# EAGLE design unoedge_v3 (EAGLE 6.5.0)
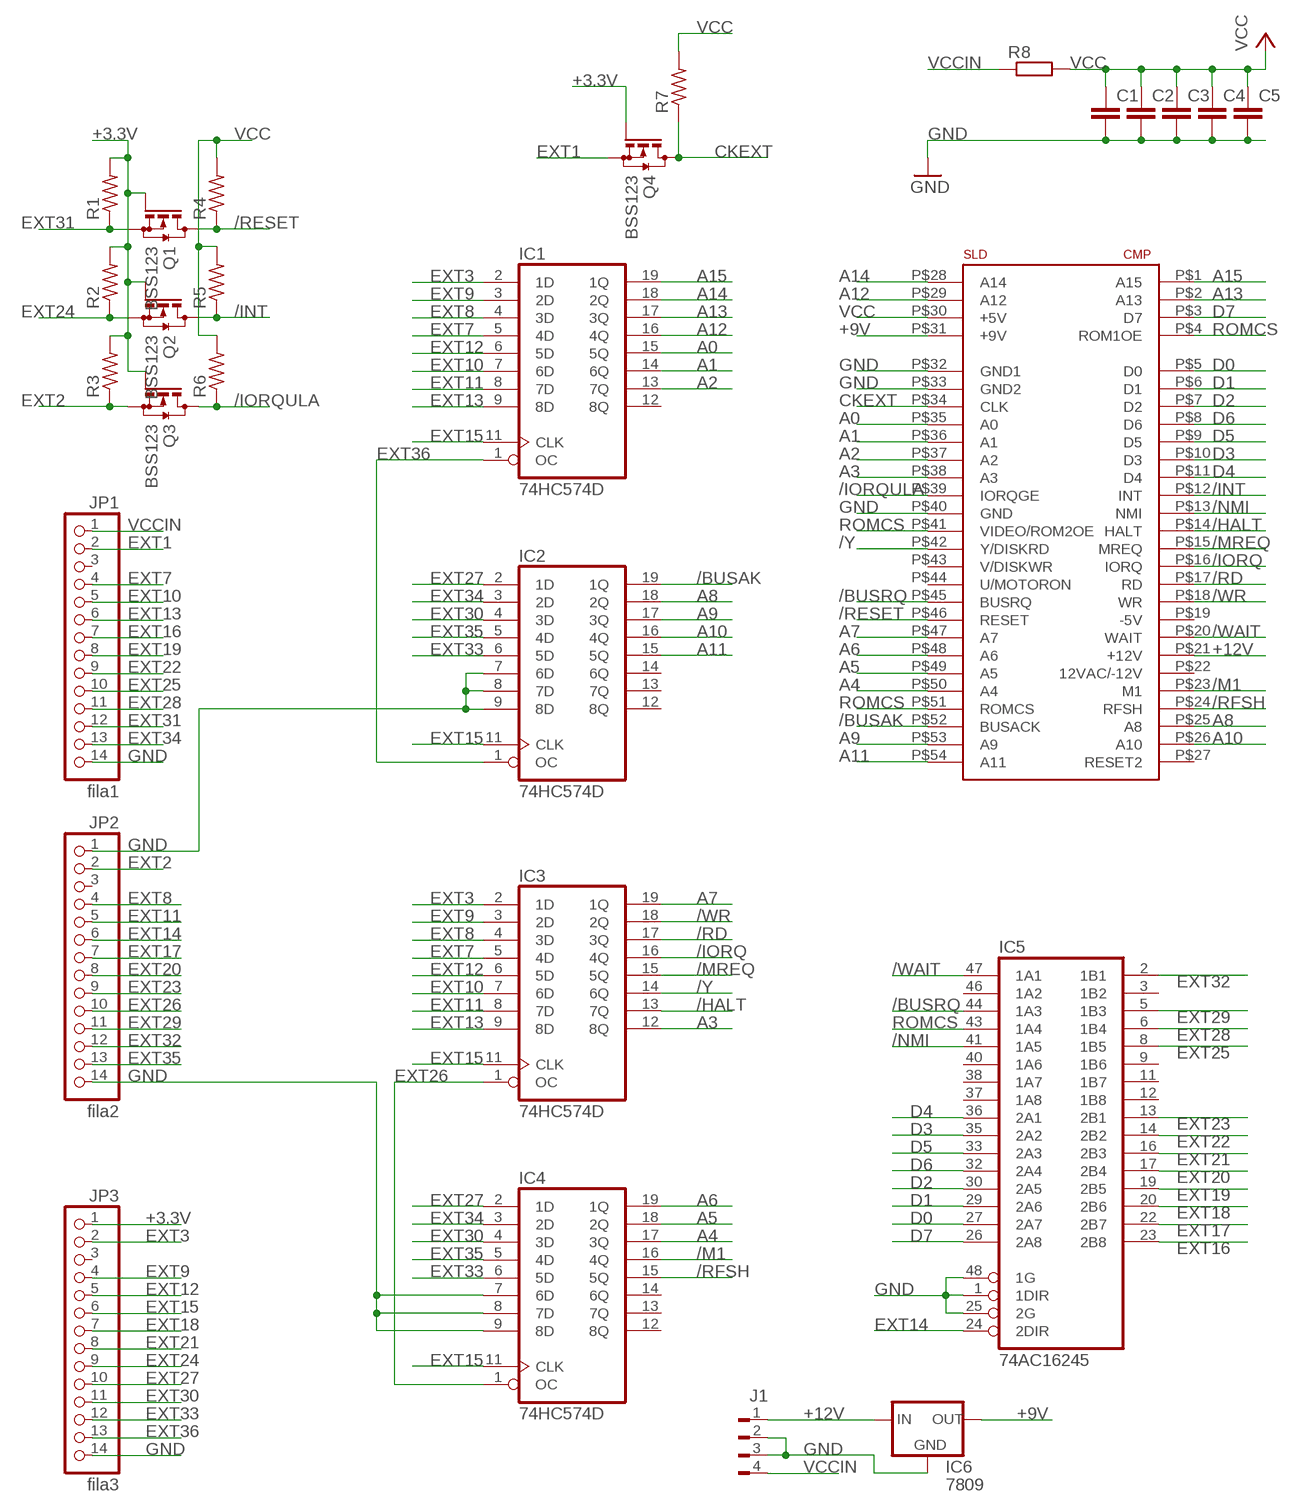
[diagram p0: schematic, sheet 1]

## Parts
C1  C-EUC0603  [C0603]
C2  C-EUC0603  [C0603]
C3  C-EUC0603  [C0603]
C4  C-EUC0603  [C0603]
C5  C-EUC0603  [C0603]
IC1  74HC574D  [SO20W]
IC2  74HC574D  [SO20W]
IC3  74HC574D  [SO20W]
IC4  74HC574D  [SO20W]
IC5  74AC16245  [SSOP48DL]
IC6  7809  78XXS  [78XXS]
J1  FLOP-4W827001  [827001]
JP1  fila1  PINHD-1X14  [1X14]
JP2  fila2  PINHD-1X14  [1X14]
JP3  fila3  PINHD-1X14  [1X14]
Q1  BSS123  [SOT23]
Q2  BSS123  [SOT23]
Q3  BSS123  [SOT23]
Q4  BSS123  [SOT23]
R1  R-US_M0805  [M0805]
R2  R-US_M0805  [M0805]
R3  R-US_M0805  [M0805]
R4  R-US_M0805  [M0805]
R5  R-US_M0805  [M0805]
R6  R-US_M0805  [M0805]
R7  R-US_M0805  [M0805]
R8  R-EU_M0805  [M0805]
U$2  CONECTOR_EDGE_LADO_SPECTRUM  [CONECTOR_LADO_SPECTRUM]

## Nets
+3.3V: JP3.1 Q1.1(G) Q2.1(G) Q3.1(G) Q4.1(G) R1.2 R2.2 R3.2
+9V: IC6.OUT U$2.P$31(+9V)
+12V: IC6.IN J1.1 U$2.P$21(+12V)
/BUSAK: IC2.19(1Q) U$2.P$52(BUSACK)
/BUSRQ: IC5.44(1A3) U$2.P$45(BUSRQ)
/HALT: IC3.13(7Q) U$2.P$14(HALT)
/INT: Q2.3(D) R5.1 U$2.P$12(INT)
/IORQ: IC3.16(4Q) U$2.P$16(IORQ)
/IORQULA: Q3.3(D) R6.1 U$2.P$39(IORQGE)
/M1: IC4.16(4Q) U$2.P$23(M1)
/MREQ: IC3.15(5Q) U$2.P$15(MREQ)
/NMI: IC5.41(1A5) U$2.P$13(NMI)
/RD: IC3.17(3Q) U$2.P$17(RD)
/RESET: Q1.3(D) R4.1 U$2.P$46(RESET)
/RFSH: IC4.15(5Q) U$2.P$24(RFSH)
/WAIT: IC5.47(1A1) U$2.P$20(WAIT)
/WR: IC3.18(2Q) U$2.P$18(WR)
/Y: IC3.14(6Q) U$2.P$42(Y/DISKRD)
A0: IC1.15(5Q) U$2.P$35(A0)
A1: IC1.14(6Q) U$2.P$36(A1)
A2: IC1.13(7Q) U$2.P$37(A2)
A3: IC3.12(8Q) U$2.P$38(A3)
A4: IC4.17(3Q) U$2.P$50(A4)
A5: IC4.18(2Q) U$2.P$49(A5)
A6: IC4.19(1Q) U$2.P$48(A6)
A7: IC3.19(1Q) U$2.P$47(A7)
A8: IC2.18(2Q) U$2.P$25(A8)
A9: IC2.17(3Q) U$2.P$53(A9)
A10: IC2.16(4Q) U$2.P$26(A10)
A11: IC2.15(5Q) U$2.P$54(A11)
A12: IC1.16(4Q) U$2.P$29(A12)
A13: IC1.17(3Q) U$2.P$2(A13)
A14: IC1.18(2Q) U$2.P$28(A14)
A15: IC1.19(1Q) U$2.P$1(A15)
CKEXT: Q4.3(D) R7.1 U$2.P$34(CLK)
D0: IC5.27(2A7) U$2.P$5(D0)
D1: IC5.29(2A6) U$2.P$6(D1)
D2: IC5.30(2A5) U$2.P$7(D2)
D3: IC5.35(2A2) U$2.P$10(D3)
D4: IC5.36(2A1) U$2.P$11(D4)
D5: IC5.33(2A3) U$2.P$9(D5)
D6: IC5.32(2A4) U$2.P$8(D6)
D7: IC5.26(2A8) U$2.P$3(D7)
EXT1: JP1.2 Q4.2(S)
EXT2: JP2.2 Q3.2(S) R3.1
EXT3: IC1.2(1D) IC3.2(1D) JP3.2
EXT7: IC1.5(4D) IC3.5(4D) JP1.4
EXT8: IC1.4(3D) IC3.4(3D) JP2.4
EXT9: IC1.3(2D) IC3.3(2D) JP3.4
EXT10: IC1.7(6D) IC3.7(6D) JP1.5
EXT11: IC1.8(7D) JP2.5
EXT12: IC1.6(5D) IC3.6(5D) JP3.5
EXT13: IC1.9(8D) IC3.9(8D) JP1.6
EXT14: IC5.24(2DIR) JP2.6
EXT15: IC1.11(CLK) IC2.11(CLK) IC3.11(CLK) IC4.11(CLK) JP3.6
EXT16: IC5.23(2B8) JP1.7
EXT17: IC5.22(2B7) JP2.7
EXT18: IC5.20(2B6) JP3.7
EXT19: IC5.19(2B5) JP1.8
EXT20: IC5.17(2B4) JP2.8
EXT21: IC5.16(2B3) JP3.8
EXT22: IC5.14(2B2) JP1.9
EXT23: IC5.13(2B1) JP2.9
EXT24: JP3.9 Q2.2(S) R2.1
EXT25: IC5.8(1B5) JP1.10
EXT26: IC3.1(OC) IC4.1(OC) JP2.10
EXT27: IC2.2(1D) IC4.2(1D) JP3.10
EXT28: IC5.6(1B4) JP1.11
EXT29: IC5.5(1B3) JP2.11
EXT30: IC2.4(3D) IC4.4(3D) JP3.11
EXT31: JP1.12 Q1.2(S) R1.1
EXT32: IC5.2(1B1) JP2.12
EXT33: IC2.6(5D) IC4.6(5D) JP3.12
EXT34: IC2.3(2D) IC4.3(2D) JP1.13
EXT35: IC2.5(4D) IC4.5(4D) JP2.13
EXT36: IC1.1(OC) IC2.1(OC) JP3.13
GND: C1.2 C2.2 C3.2 C4.2 C5.2 IC2.7(6D) IC2.8(7D) IC2.9(8D) IC4.7(6D) IC4.8(7D) IC4.9(8D) IC5.1(1DIR) IC5.25(2G) IC5.48(1G) IC6.GND J1.2 J1.3 JP1.14 JP2.1 JP2.14 JP3.14 U$2.P$32(GND1) U$2.P$33(GND2) U$2.P$40(GND)
ROMCS: IC5.43(1A4) U$2.P$4(ROM1OE) U$2.P$41(VIDEO/ROM2OE) U$2.P$51(ROMCS)
VCC: C1.1 C2.1 C3.1 C4.1 C5.1 R4.2 R5.2 R6.2 R7.2 R8.2 U$2.P$30(+5V)
VCCIN: J1.4 JP1.1 R8.1
Unconnected: IC1.12(8Q) IC2.12(8Q) IC2.13(7Q) IC2.14(6Q) IC3.8(7D) IC4.12(8Q) IC4.13(7Q) IC4.14(6Q) IC5.3(1B2) IC5.9(1B6) IC5.11(1B7) IC5.12(1B8) IC5.37(1A8) IC5.38(1A7) IC5.40(1A6) IC5.46(1A2) JP1.3 JP2.3 JP3.3 U$2.P$19(-5V) U$2.P$22(12VAC/-12V) U$2.P$27(RESET2) U$2.P$43(V/DISKWR) U$2.P$44(U/MOTORON)

## Power pins joined to a net without a drawn wire
GND: IC1.10(GND) IC2.10(GND) IC3.10(GND) IC4.10(GND) IC5.4(GND) IC5.10(GND) IC5.15(GND) IC5.21(GND) IC5.28(GND) IC5.34(GND) IC5.39(GND) IC5.45(GND)
VCC: IC1.20(VCC) IC2.20(VCC) IC3.20(VCC) IC4.20(VCC) IC5.7(VCC) IC5.18(VCC) IC5.31(VCC) IC5.42(VCC)

## Library data of the parts
C1-C5 = rcl:C-EU: CAPACITOR, European symbol
IC1-IC4 = 74xx-eu:74*574: 8-bit D type FLIP FLOP bus driver
IC5 = 74ac-logic:74AC16245: 16-bit BUS TRANSCEIVER, 3-state
IC6 = v-reg:78XXS: VOLTAGE REGULATOR
J1 = con-amp:FLOP-4W: MATE N-LOCK Floppy / HDD conector Distributor: Bürklin 71F972
JP1-JP3 = pinhead:PINHD-1X14: PIN HEADER
Q1-Q4 = transistor-small-signal:BSS123: N-CHANNEL MOS FET
R1-R7 = rcl:R-US_: RESISTOR, American symbol
R8 = rcl:R-EU_: RESISTOR, European symbol
U$2 = zx_bus_connector_lado_spectrum:CONECTOR_EDGE_LADO_SPECTRUM

## Board
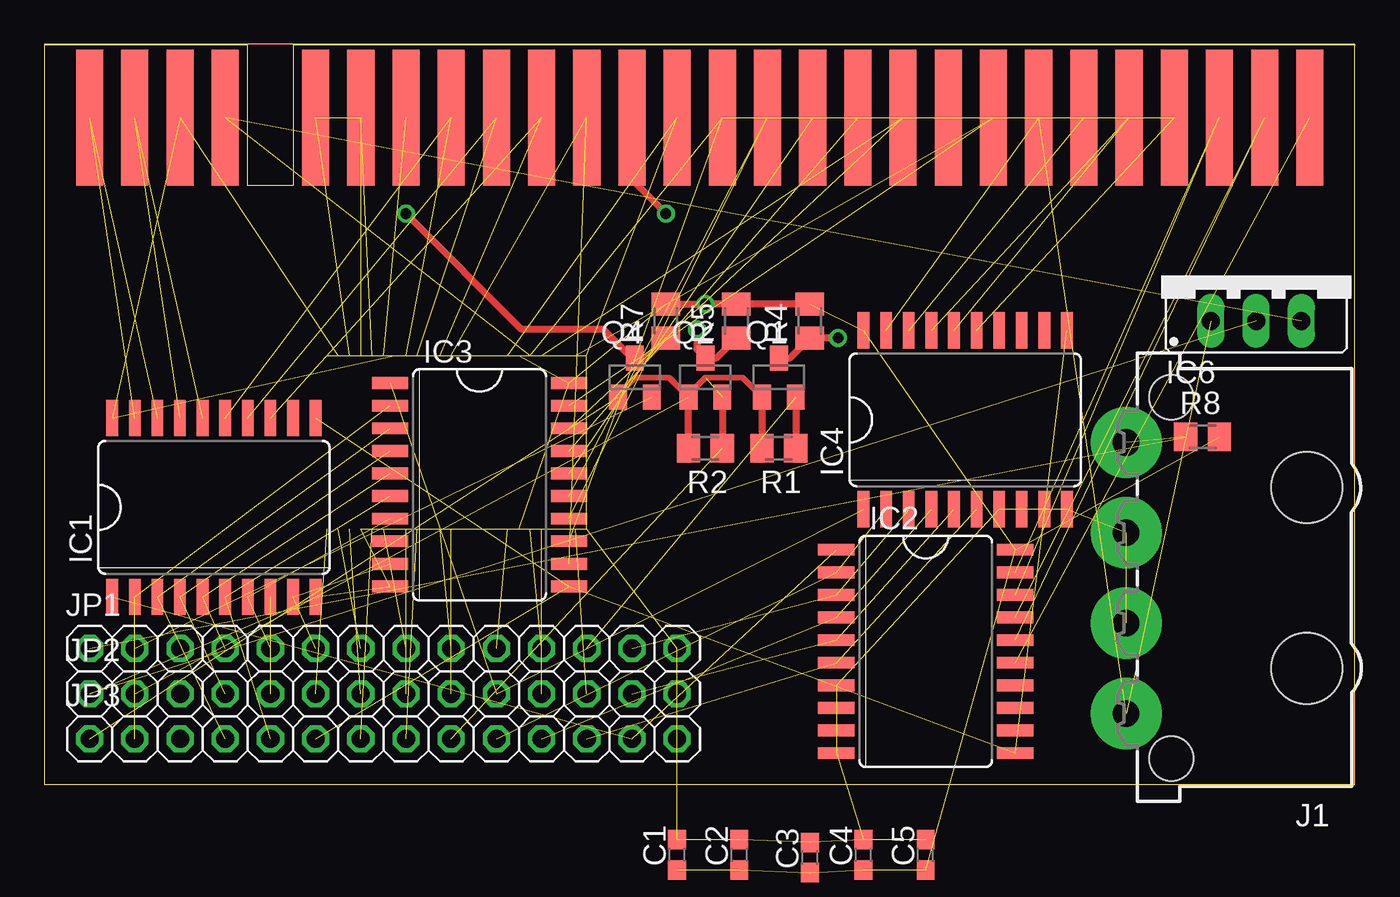
[diagram p1: board, top side]
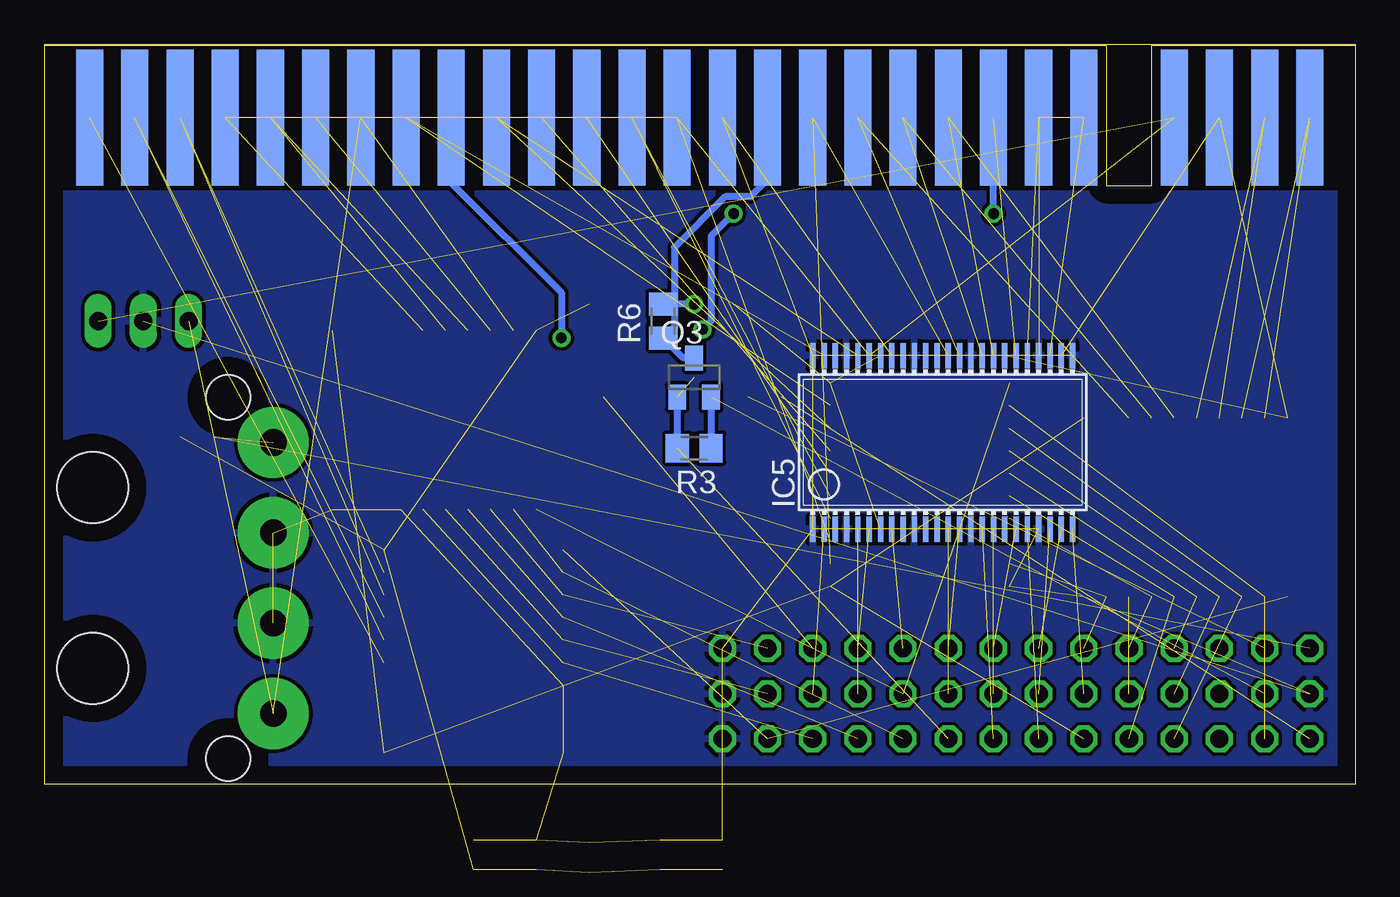
[diagram p2: board, bottom side, seen from below]

Size 73.66 x 41.58 mm. Coordinates in mm from the lower left corner, seen from the top.
Outline: 0,0 73.64,0 73.64,41.58 0,41.58 0,0
Copper layers (1*16): Top 0.035mm / dielectric 1.5mm / Bottom 0.035mm
Design rules "default": minimum track width 10mil, minimum drill 24mil, track to track 8mil, track to pad 8mil, pad to pad 8mil, via to via 8mil, smd to smd 8mil, copper to edge 40mil, drill to drill 8mil, minimum pad ring 10mil, minimum via ring 8mil, stop-mask expansion 4mil, vias tented up to drill 0mil, thermal gap 10mil

### Footprints (pad centres in the part's own frame; a part is rotated, then mirrored left to right if it is on the bottom)
C0603 = smd 1.1 x 1: 1 -0.85,0; 2 0.85,0
SO20W = smd 0.66 x 2.032: 1 -5.715,-5.029; 2 -4.445,-5.029; 3 -3.175,-5.029; 4 -1.905,-5.029; 5 -0.635,-5.029; 6 0.635,-5.029; 7 1.905,-5.029; 8 3.175,-5.029; 9 4.445,-5.029; 10 5.715,-5.029; 11 5.715,5.029; 12 4.445,5.029; 13 3.175,5.029; 14 1.905,5.029; 15 0.635,5.029; 16 -0.635,5.029; 17 -1.905,5.029; 18 -3.175,5.029; 19 -4.445,5.029; 20 -5.715,5.029
SSOP48DL = smd 0.305 x 1.422: 1 -6.985,-4.877; 2 -6.35,-4.877; 3 -5.715,-4.877; 4 -5.08,-4.877; 5 -4.445,-4.877; 6 -3.81,-4.877; 7 -3.175,-4.877; 8 -2.54,-4.877; 9 -1.905,-4.877; 10 -1.27,-4.877; 11 -0.635,-4.877; 12 0,-4.877; 13 0.635,-4.877; 14 1.27,-4.877; 15 1.905,-4.877; 16 2.54,-4.877; 17 3.175,-4.877; 18 3.81,-4.877; 19 4.445,-4.877; 20 5.08,-4.877; 21 5.715,-4.877; 22 6.35,-4.877; 23 6.985,-4.877; 24 7.62,-4.877; 25 7.62,4.877; 26 6.985,4.877; 27 6.35,4.877; 28 5.715,4.877; 29 5.08,4.877; 30 4.445,4.877; 31 3.81,4.877; 32 3.175,4.877; 33 2.54,4.877; 34 1.905,4.877; 35 1.27,4.877; 36 0.635,4.877; 37 0,4.877; 38 -0.635,4.877; 39 -1.27,4.877; 40 -1.905,4.877; 41 -2.54,4.877; 42 -3.175,4.877; 43 -3.81,4.877; 44 -4.445,4.877; 45 -5.08,4.877; 46 -5.715,4.877; 47 -6.35,4.877; 48 -6.985,4.877
78XXS = drill 1.016 long: GND 0,-2.54; IN -2.54,-2.54; OUT 2.54,-2.54
827001 = drill 1.5 pad 4: 1 -7.62,0; 2 -2.54,0; 3 2.54,0; 4 7.62,0 | hole 4: 5.08,-10.16; -5.08,-10.16 | hole 2.5: 10.16,-2.54; -10.16,-2.54
1X14 = drill 1.016 octagon: 1 -16.51,0; 2 -13.97,0; 3 -11.43,0; 4 -8.89,0; 5 -6.35,0; 6 -3.81,0; 7 -1.27,0; 8 1.27,0; 9 3.81,0; 10 6.35,0; 11 8.89,0; 12 11.43,0; 13 13.97,0; 14 16.51,0
SOT23 = smd 1 x 1.4: 1 -0.95,-1.1; 2 0.95,-1.1; 3 0,1.1
M0805 = smd 1.3 x 1.6: 1 -0.95,0; 2 0.95,0
CONECTOR_LADO_SPECTRUM = smd 7.62 x 1.524: P$1 2.54,2.54; P$2 2.54,0; P$3 2.54,-2.54; P$4 2.54,-5.08; P$5 2.54,-10.16; P$6 2.54,-12.7; P$7 2.54,-15.24; P$8 2.54,-17.78; P$9 2.54,-20.32; P$10 2.54,-22.86; P$11 2.54,-25.4; P$12 2.54,-27.94; P$13 2.54,-30.48; P$14 2.54,-33.02; P$15 2.54,-35.56; P$16 2.54,-38.1; P$17 2.54,-40.64; P$18 2.54,-43.18; P$19 2.54,-45.72; P$20 2.54,-48.26; P$21 2.54,-50.8; P$22 2.54,-53.34; P$23 2.54,-55.88; P$24 2.54,-58.42; P$25 2.54,-60.96; P$26 2.54,-63.5; P$27 2.54,-66.04 | smd 7.62 x 1.524 bottom: P$28 2.54,2.54; P$29 2.54,0; P$30 2.54,-2.54; P$31 2.54,-5.08; P$32 2.54,-10.16; P$33 2.54,-12.7; P$34 2.54,-15.24; P$35 2.54,-17.78; P$36 2.54,-20.32; P$37 2.54,-22.86; P$38 2.54,-25.4; P$39 2.54,-27.94; P$40 2.54,-30.48; P$41 2.54,-33.02; P$42 2.54,-35.56; P$43 2.54,-38.1; P$44 2.54,-40.64; P$45 2.54,-43.18; P$46 2.54,-45.72; P$47 2.54,-48.26; P$48 2.54,-50.8; P$49 2.54,-53.34; P$50 2.54,-55.88; P$51 2.54,-58.42; P$52 2.54,-60.96; P$53 2.54,-63.5; P$54 2.54,-66.04

### Placement (x,y rotation side)
C1  35.56,-3.97 90 top  (outside the outline)
C2  39.05,-3.97 90 top  (outside the outline)
C3  43.02,-4.13 90 top  (outside the outline)
C4  46.04,-3.97 90 top  (outside the outline)
C5  49.53,-3.97 90 top  (outside the outline)
IC1  9.53,15.56 0 top
IC2  49.53,7.46 270 top
IC3  24.45,16.83 270 top
IC4  51.75,20.48 0 top
IC5  23.5,19.21 0 bottom
IC6  68.1,28.57 0 top
J1  60.8,11.59 90 top
JP1  19.05,7.62 0 top
JP2  19.05,5.08 0 top
JP3  19.05,2.54 0 top
Q1  41.27,22.86 0 top
Q2  37.15,22.86 0 top
Q3  37.15,22.86 0 bottom
Q4  33.18,22.86 0 top
R1  41.27,18.89 180 top
R2  37.15,18.89 180 top
R3  37.15,18.89 180 bottom
R4  43.02,26.04 90 top
R5  38.89,26.04 90 top
R6  38.89,26.04 90 bottom
R7  34.92,26.04 90 top
R8  65.09,19.53 0 top
U$2  5.08,34.92 90 top

### Tracks (layer width: path | path; a pad name or v marks a point on that pad's centre or on a via)
+3.3V  (2 unrouted)
  Top 0.305: Q4.1 32.23,21.91 33.18,22.86 35.1,22.86 Q2.1 36.2,21.91 37.15,22.86 39.23,22.86 Q1.1
  Top 0.406: Q1.1 R1.2 | R2.2 Q2.1
  Bottom 0.406: Q3.1 R3.2
+9V  (1 unrouted)
+12V  (2 unrouted)
/BUSAK  (1 unrouted)
/BUSRQ  (1 unrouted)
/HALT  (1 unrouted)
/INT  (via drill 0.6)
  Top 0.406: R5.1 37.77,23.96 Q2.3 36.67,24.44 v36.67,25.56 | U$2.P$12 33.02,33.97 v34.92,32.07
  Bottom 0.406: v34.92,32.07 36.2,30.8 36.2,26.04 v36.67,25.56
/IORQ  (1 unrouted)
/IORQULA
  Bottom 0.406: Q3.3 37.77,23.96 R6.1 38.26,25.72 38.26,30.16 35.4,33.02 33.97,33.02 33.02,33.97 U$2.P$39
/M1  (1 unrouted)
/MREQ  (1 unrouted)
/NMI  (1 unrouted)
/RD  (1 unrouted)
/RESET  (via drill 0.6)
  Top 0.406: Q1.3 41.9,23.96 R4.1 v44.61,25.08
  Bottom 0.406: U$2.P$46 50.8,33.81 44.61,27.62 v44.61,25.08
/RFSH  (1 unrouted)
/WAIT  (1 unrouted)
/WR  (1 unrouted)
/Y  (1 unrouted)
A0  (1 unrouted)
A1  (1 unrouted)
A2  (1 unrouted)
A3  (1 unrouted)
A4  (1 unrouted)
A5  (1 unrouted)
A6  (1 unrouted)
A7  (1 unrouted)
A8  (1 unrouted)
A9  (1 unrouted)
A10  (1 unrouted)
A11  (1 unrouted)
A12  (1 unrouted)
A13  (1 unrouted)
A14  (1 unrouted)
A15  (1 unrouted)
CKEXT  (via drill 0.6)
  Top 0.406: R7.1 33.8,23.96 Q4.3 33.03,23.96 31.43,25.56 26.83,25.56 v20.32,32.07
  Bottom 0.406: v20.32,32.07 U$2.P$34
D0  (1 unrouted)
D1  (1 unrouted)
D2  (1 unrouted)
D3  (1 unrouted)
D4  (1 unrouted)
D5  (1 unrouted)
D6  (1 unrouted)
D7  (1 unrouted)
EXT1  (1 unrouted)
EXT2  (1 unrouted)
  Bottom 0.406: Q3.2 R3.1
EXT3  (2 unrouted)
EXT7  (2 unrouted)
EXT8  (2 unrouted)
EXT9  (2 unrouted)
EXT10  (2 unrouted)
EXT11  (1 unrouted)
EXT12  (2 unrouted)
EXT13  (2 unrouted)
EXT14  (1 unrouted)
EXT15  (4 unrouted)
EXT16  (1 unrouted)
EXT17  (1 unrouted)
EXT18  (1 unrouted)
EXT19  (1 unrouted)
EXT20  (1 unrouted)
EXT21  (1 unrouted)
EXT22  (1 unrouted)
EXT23  (1 unrouted)
EXT24  (1 unrouted)
  Top 0.406: Q2.2 R2.1
EXT25  (1 unrouted)
EXT26  (2 unrouted)
EXT27  (2 unrouted)
EXT28  (1 unrouted)
EXT29  (1 unrouted)
EXT30  (2 unrouted)
EXT31  (1 unrouted)
  Top 0.406: Q1.2 R1.1
EXT32  (1 unrouted)
EXT33  (2 unrouted)
EXT34  (2 unrouted)
EXT35  (2 unrouted)
EXT36  (2 unrouted)
GND  (35 unrouted)
  pour Bottom: 0.79,33.18 72.87,33.18 72.87,0.32 0.64,0.32 0.64,33.18
ROMCS  (3 unrouted)
VCC  (via drill 0.6)  (15 unrouted)
  Top 0.406: R4.2 R5.2 v37.15,26.98 v37.15,26.99 v37.15,26.98 R7.2
  Bottom 0.406: v37.15,26.99 R5.2
VCCIN  (2 unrouted)